# EAGLE design wad-pcb (EAGLE 9.6.2)
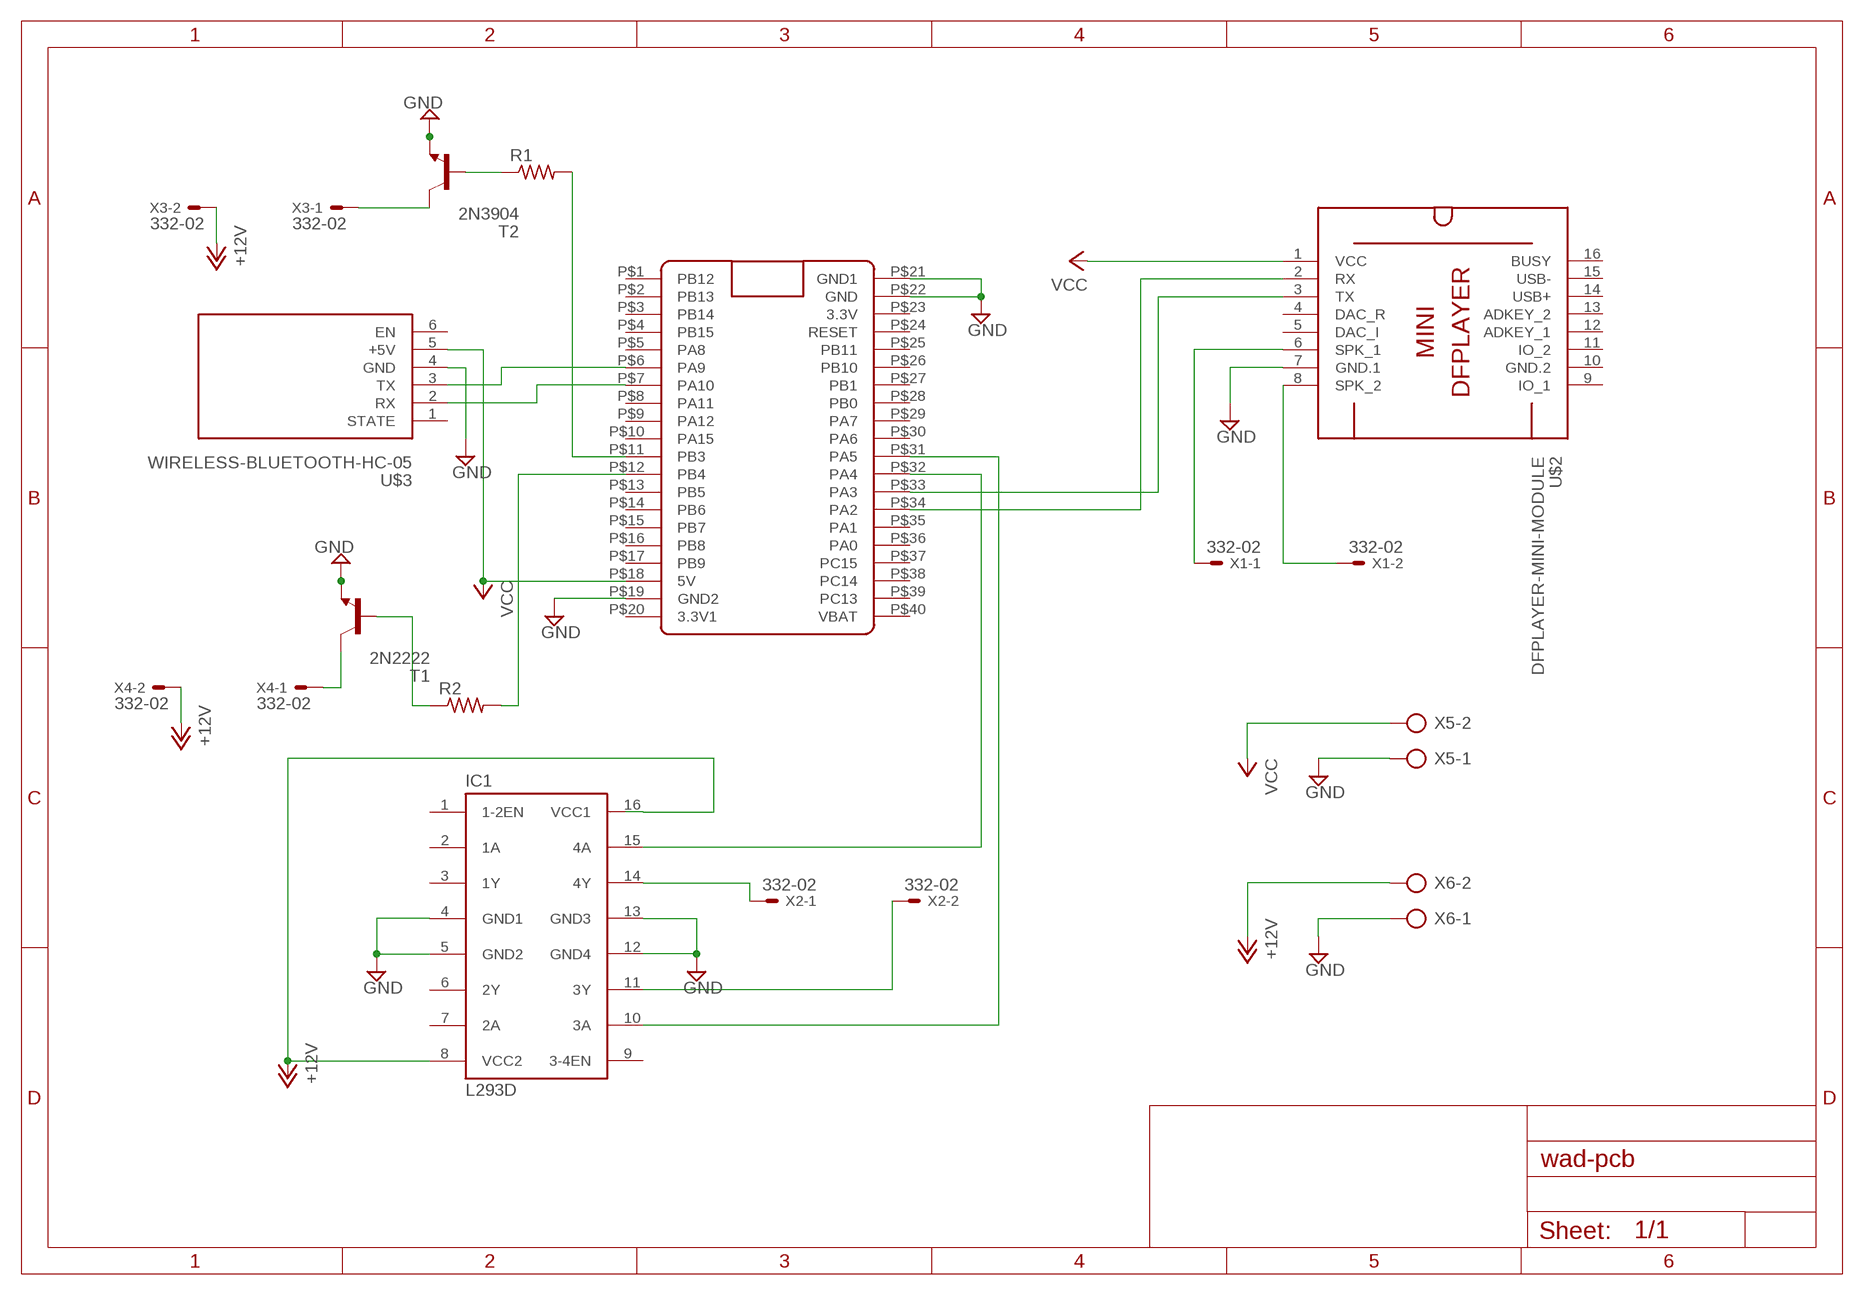
[diagram p0: schematic, sheet 1]

## Parts
IC1  L293D  [DIL16]
R1  R-US_0204/7  [0204/7]
R2  R-US_0204/7  [0204/7]
T1  2N2222  [TO18]
T2  2N3904  [TO92]
U$1  BLUE_PILL  [BLUE_PILL]
U$2  DFPLAYER-MINI-MODULE  [DFPLAYER-MINI-MODULE]
U$3  WIRELESS-BLUETOOTH-HC-05  [WIRELESS-BLUETOOTH-HC-05]
X1  332-02  [332-02]
X2  332-02  [332-02]
X3  332-02  [332-02]
X4  332-02  [332-02]
X5  AK500/2-H  [AK500/2-H]
X6  AK500/2-H  [AK500/2-H]

## Nets
+12V: IC1.8(VCC2) IC1.16(VCC1) X3.2 X4.2 X6.2
GND: IC1.4(GND1) IC1.5(GND2) IC1.12(GND4) IC1.13(GND3) T1.1(E) T2.3(E) U$1.P$19(GND2) U$1.P$21(GND1) U$1.P$22(GND) U$2.7(GND.1) U$3.4(GND) X5.1 X6.1
N$1: U$1.P$6(PA9) U$3.3(TX)
N$2: U$1.P$7(PA10) U$3.2(RX)
N$3: R1.1 T2.2(B)
N$4: R1.2 U$1.P$11(PB3)
N$5: R2.1 T1.2(B)
N$6: R2.2 U$1.P$12(PB4)
N$7: T2.1(C) X3.1
N$8: T1.3(C) X4.1
N$9: U$1.P$34(PA2) U$2.2(RX)
N$10: U$1.P$33(PA3) U$2.3(TX)
N$12: U$2.6(SPK_1) X1.1
N$13: U$2.8(SPK_2) X1.2
N$14: IC1.15(4A) U$1.P$32(PA4)
N$15: IC1.10(3A) U$1.P$31(PA5)
N$16: IC1.14(4Y) X2.1
N$17: IC1.11(3Y) X2.2
VCC: U$1.P$18(5V) U$2.1(VCC) U$3.5(+5V) X5.2
Unconnected: IC1.1(1-2EN) IC1.2(1A) IC1.3(1Y) IC1.6(2Y) IC1.7(2A) IC1.9(3-4EN) U$1.P$1(PB12) U$1.P$2(PB13) U$1.P$3(PB14) U$1.P$4(PB15) U$1.P$5(PA8) U$1.P$8(PA11) U$1.P$9(PA12) U$1.P$10(PA15) U$1.P$13(PB5) U$1.P$14(PB6) U$1.P$15(PB7) U$1.P$16(PB8) U$1.P$17(PB9) U$1.P$20(3.3V1) U$1.P$23(3.3V) U$1.P$24(RESET) U$1.P$25(PB11) U$1.P$26(PB10) U$1.P$27(PB1) U$1.P$28(PB0) U$1.P$29(PA7) U$1.P$30(PA6) U$1.P$35(PA1) U$1.P$36(PA0) U$1.P$37(PC15) U$1.P$38(PC14) U$1.P$39(PC13) U$1.P$40(VBAT) U$2.4(DAC_R) U$2.5(DAC_I) U$2.9(IO_1) U$2.11(IO_2) U$2.12(ADKEY_1) U$2.13(ADKEY_2) U$2.14(USB+) U$2.15(USB-) U$2.16(BUSY) U$3.1(STATE) U$3.6(EN)

## Power pins joined to a net without a drawn wire
GND.2: U$2.10(GND.2)

## Library data of the parts
IC1 = st-microelectronics:L293D: PUSH-PULL 4 CHANNEL DRIVER; MPN: L293D; OC_FARNELL: 9589619; OC_NEWARK: 56P8249
R1 R2 = rcl:R-US_: RESISTOR, American symbol; SPICEPREFIX: R
T1 = transistor:2N2222: NPN TRANSISTOR
T2 = transistor2:2N3904: NPN TRANSISTOR
U$1 = BluePill:BLUE_PILL
U$2 = diy-modules:DFPLAYER-MINI-MODULE: DFPlayer Mini - MP3 player module based on YX5200 chip More details available here: https://www.dfrobot.com/wiki/index.php/DFPlayer_Mini_SKU:DFR0299 Click here to find device on ebay.com <http://www.ebay.com/sch/dfplayer+mini>
U$3 = diy-modules:WIRELESS-BLUETOOTH-HC-05: Bluetooth Transceiver Module based on HC-05 board Tutorial is available here: https://arduino-info.wikispaces.com/BlueTooth-HC05-HC06-Modules-How-To Click here to find device on ebay.com <http://www.ebay.com/sch/hc-05+module+rs232>
X1-X4 = con-garry:332-02: 2 Pin - 2mm Dual Row Source: www.mpe-connector.de / garry_shortform_2012.pdf
X5 X6 = con-ptr500:AK500/2-H: CONNECTOR Aug. 2004 / PTR Meßtechnik: Die Bezeichnung der Serie AK505 wurde geändert. Es handelt sich hierbei um AK500 in horizontaler Ausführung.; OC_FARNELL: unknown; OC_NEWARK: unknown

## Board
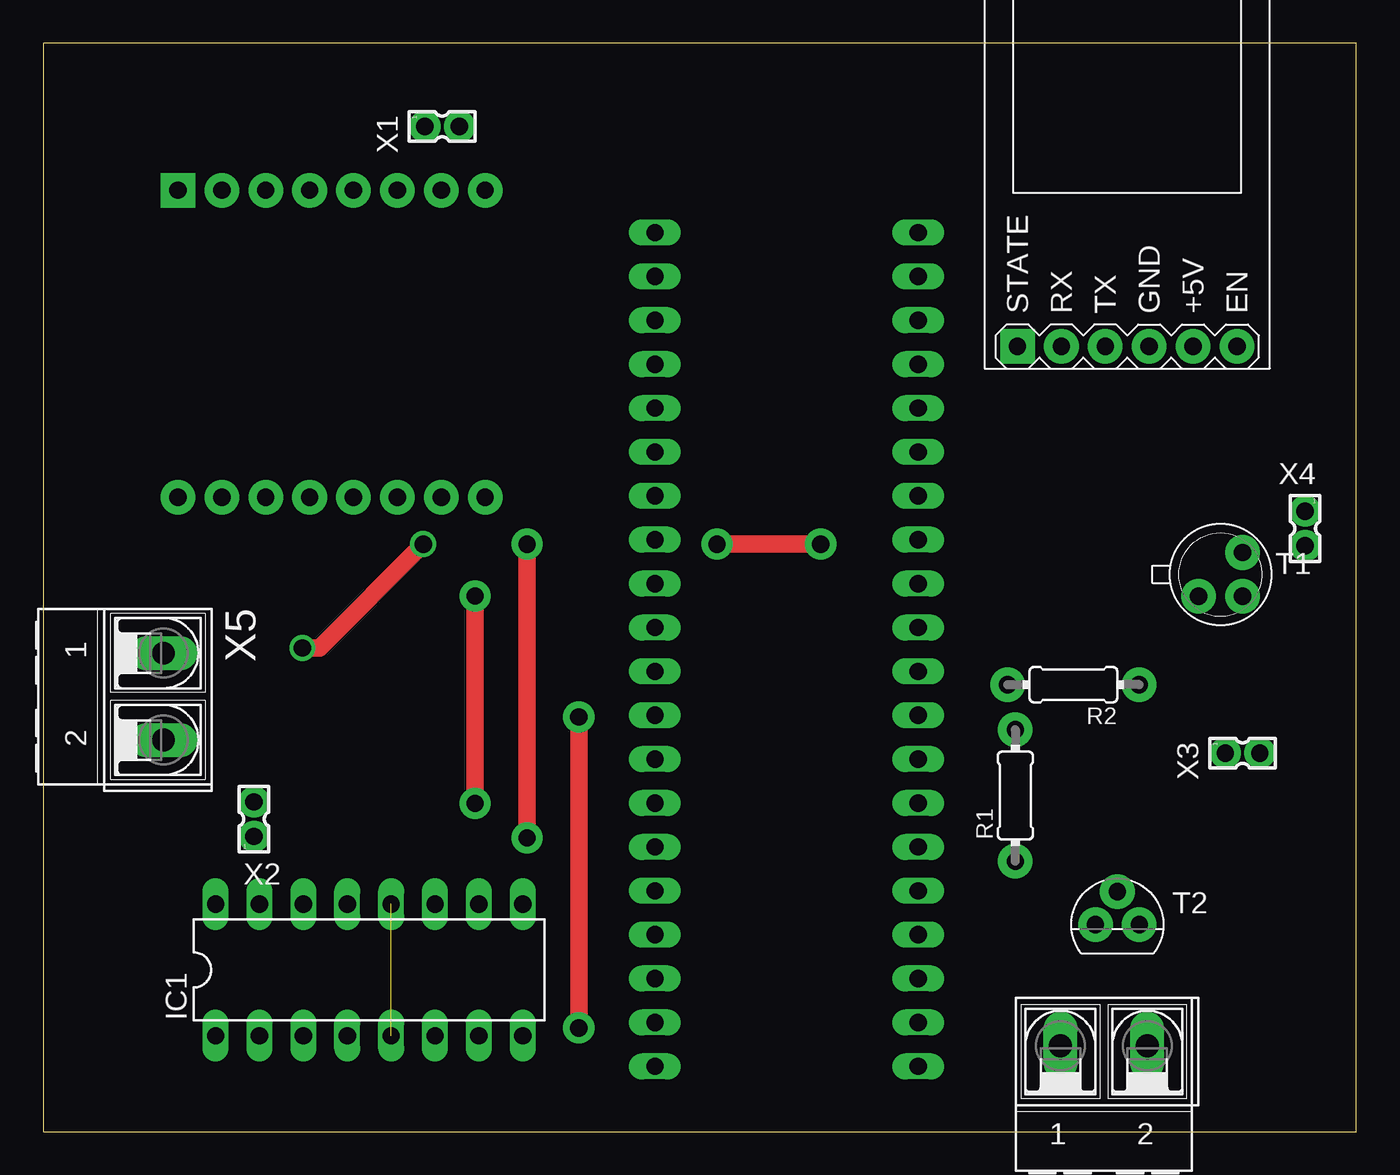
[diagram p1: board, top side]
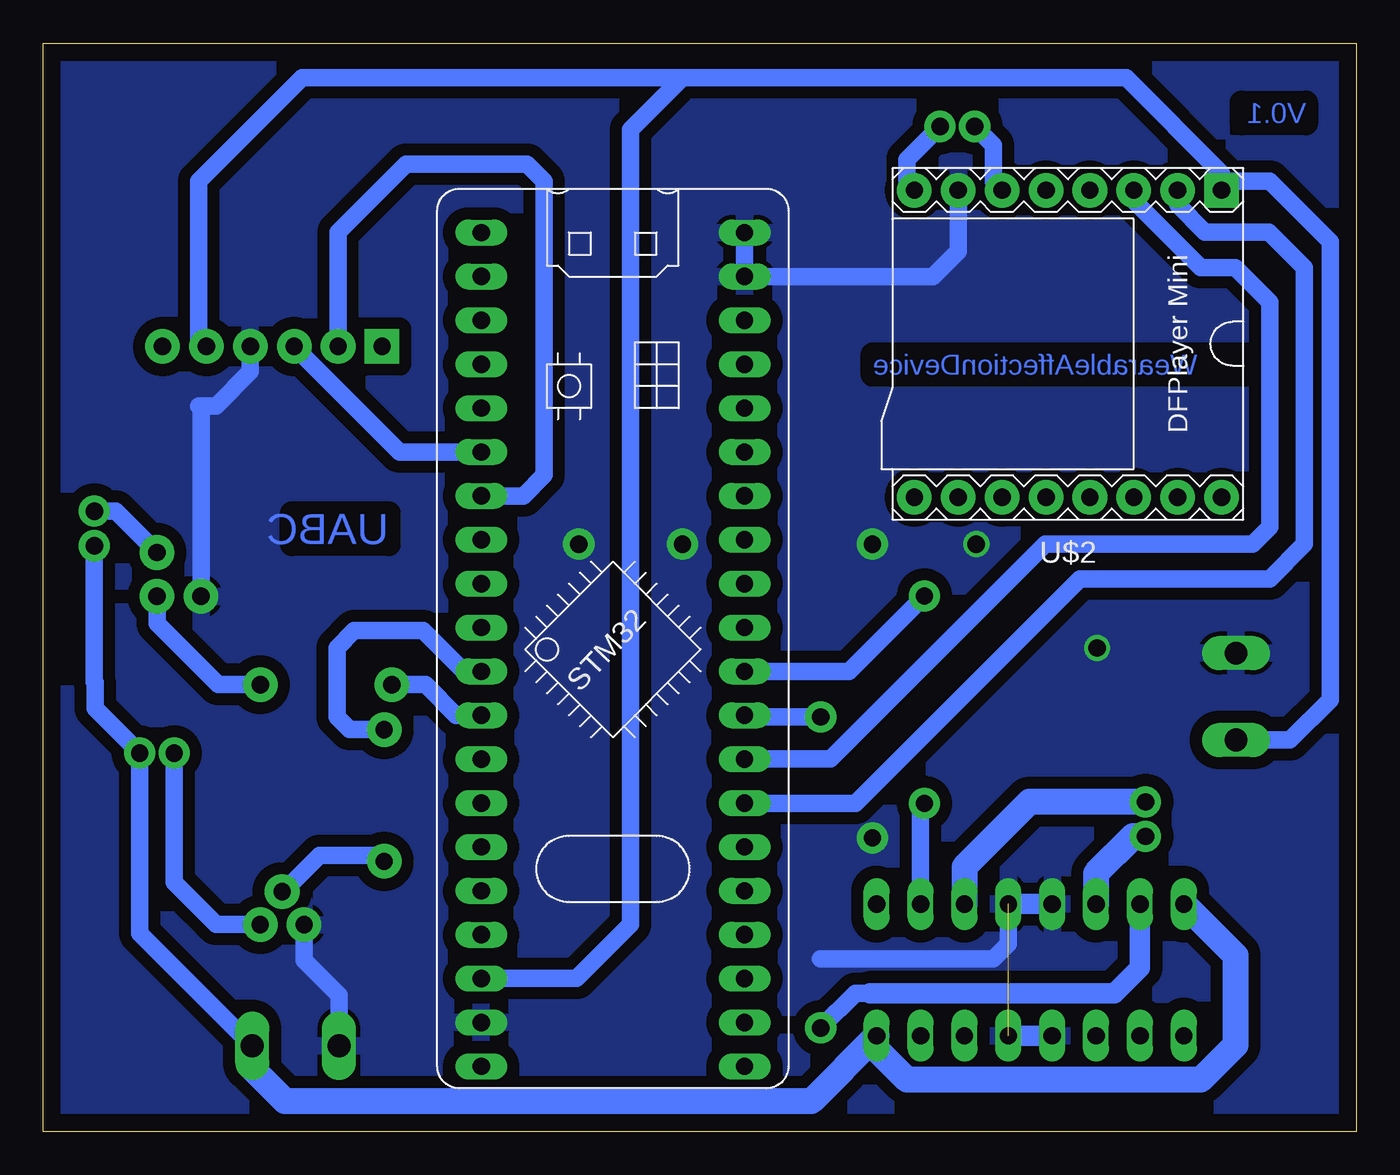
[diagram p2: board, bottom side, seen from below]

Size 76 x 63 mm. Coordinates in mm from the lower left corner, seen from the top.
Outline: 0,0 76,0 76,63 0,63 0,0
Copper layers (1*16): Top 0.035mm / dielectric 1.5mm / Bottom 0.035mm
Design rules "default": minimum track width 6mil, minimum drill 0.35mm, track to track 6mil, track to pad 6mil, pad to pad 6mil, via to via 6mil, smd to smd 6mil, copper to edge 40mil, drill to drill 6mil, minimum pad ring 10mil, minimum via ring 8mil, stop-mask expansion 4mil, vias tented up to drill 0mil, thermal gap 10mil

### Footprints (pad centres in the part's own frame; a part is rotated, then mirrored left to right if it is on the bottom)
DIL16 = drill 1 pad 1.5 long: 1 -8.89,-3.81; 2 -6.35,-3.81; 3 -3.81,-3.81; 4 -1.27,-3.81; 5 1.27,-3.81; 6 3.81,-3.81; 7 6.35,-3.81; 8 8.89,-3.81; 9 8.89,3.81; 10 6.35,3.81; 11 3.81,3.81; 12 1.27,3.81; 13 -1.27,3.81; 14 -3.81,3.81; 15 -6.35,3.81; 16 -8.89,3.81
0204/7 = drill 1 pad 2: 1 -3.81,0; 2 3.81,0
TO18 = drill 1 pad 2: 1 -1.27,-1.27; 2 1.27,-1.27; 3 1.27,1.27
TO92 = drill 1 pad 2: 1 1.27,0; 2 0,1.905; 3 -1.27,0
BLUE_PILL = drill 1 long: P$1 -7.62,15.24; P$2 -7.62,12.7; P$3 -7.62,10.16 | drill 1 pad 1.5 long: P$4 -7.62,7.62; P$5 -7.62,5.08; P$6 -7.62,2.54; P$7 -7.62,0; P$8 -7.62,-2.54; P$9 -7.62,-5.08; P$10 -7.62,-7.62; P$11 -7.62,-10.16; P$12 -7.62,-12.7; P$13 -7.62,-15.24; P$14 -7.62,-17.78; P$15 -7.62,-20.32; P$16 -7.62,-22.86; P$17 -7.62,-25.4; P$18 -7.62,-27.94; P$19 -7.62,-30.48; P$20 -7.62,-33.02; P$21 7.62,15.24; P$22 7.62,12.7; P$23 7.62,10.16; P$24 7.62,7.62; P$25 7.62,5.08; P$26 7.62,2.54; P$27 7.62,0; P$28 7.62,-2.54; P$29 7.62,-5.08; P$30 7.62,-7.62; P$31 7.62,-10.16; P$32 7.62,-12.7; P$33 7.62,-15.24; P$34 7.62,-17.78; P$35 7.62,-20.32; P$36 7.62,-22.86; P$37 7.62,-25.4; P$38 7.62,-27.94; P$39 7.62,-30.48; P$40 7.62,-33.02
DFPLAYER-MINI-MODULE = drill 1 pad 2 square: 1 -8.89,-8.89 | drill 1 pad 2: 2 -6.35,-8.89; 3 -3.81,-8.89; 4 -1.27,-8.89; 5 1.27,-8.89; 6 3.81,-8.89; 7 6.35,-8.89; 8 8.89,-8.89; 9 8.89,8.89; 10 6.35,8.89; 11 3.81,8.89; 12 1.27,8.89; 13 -1.27,8.89; 14 -3.81,8.89; 15 -6.35,8.89; 16 -8.89,8.89
WIRELESS-BLUETOOTH-HC-05 = drill 1 pad 2 square: 1 -6.35,-17.145 | drill 1 pad 2: 2 -3.81,-17.145; 3 -1.27,-17.145; 4 1.27,-17.145; 5 3.81,-17.145; 6 6.35,-17.145
332-02 = drill 1 pad 1.8: 1 0,-1; 2 0,1
AK500/2-H = drill 1.321 long: 1 -2.515,0; 2 2.515,0

### Placement (x,y rotation side)
IC1  18.87,9.36 0 top
R1  56.26,19.45 90 top
R2  59.62,25.87 180 top
T1  68.14,32.25 0 top
T2  62.17,11.98 0 top
U$1  43.03,36.8 0 bottom
U$2  16.69,45.6 180 bottom
U$3  62.74,62.59 0 top
X1  23.09,58.18 270 top
X2  12.2,18.09 0 top
X3  69.42,21.91 270 top
X4  73.04,34.91 180 top
X5  6.96,25.18 270 top
X6  61.39,4.96 0 top

### Tracks (layer width: path | path; a pad name or v marks a point on that pad's centre or on a via)
+12V
  Bottom 1: X3.2 70.51,22 | X6.2 70.42,11.47 X3.2 | X4.2 73.04,26.04 73,26 73,24.49 X3.2
  Bottom 1.5: X6.2 63.91,3.67 62,1.77 31.54,1.77 IC1.8 27.76,4.76 26,3 9,3 7,5 7,10.19 IC1.16
GND  (via drill 1 pad 1, 1 pad 1.8)  (1 unrouted)
  Top 1: v28,34 v28,17 | v39,34 v45,34 | v22,34 16,28 v15,28
  Bottom 1: U$3.4 64.01,43.99 66,42 67,42 66.87,41.87 T1.1 | 31,10 21,10 20.14,10.86 IC1.12 | T2.3 60.9,9.9 58.88,7.88 X6.1 | U$2.7 23.04,50.96 24.5,49.5 U$1.P$22 U$1.P$21
  Bottom 1.2: IC1.13 IC1.12 | IC1.4 IC1.5
  pour Bottom (isolate 0.7): 0,63 76,63 76,0 0,0
N$1
  Bottom 1: U$3.3 55.36,39.34 U$1.P$6
N$2
  Bottom 1: U$3.2 58.93,52.07 55,56 48,56 47,55 47,38 48.2,36.8 U$1.P$7
N$3
  Bottom 1: T2.2 62.12,13.88 60,16 56.62,16 R1.1
N$4
  Bottom 1: 55.73,23.27 R1.2 58.27,23.27 59,24 59,28 58,29 54,29 51.64,26.64 U$1.P$11
N$5
  Bottom 1: T1.2 69.41,29.41 65.87,25.87 R2.1
N$6
  Bottom 1: R2.2 53.87,25.87 52.1,24.1 U$1.P$12
N$7
  Bottom 1: T2.1 63.46,12 66,12 68.42,14.42 X3.1
N$8
  Bottom 1: X4.1 71.8,35.91 T1.3
N$9
  Bottom 1: U$1.P$34 35.39,19 29,19 16,32 5,32 3,34 3,50 5.07,52.07 8.76,52.07 10.34,53.65 U$2.2
N$10
  Bottom 1: U$2.3 12.88,53.88 9,50 7,50 5,48 5,35 6,34 18,34 30.44,21.56 U$1.P$33
N$12
  Bottom 1: X1.1 21,57.09 21,54.99 U$2.6
N$13
  Bottom 1: X1.2 26,56.27 26,54.91 U$2.8
N$14  (via drill 1 pad 1.8)
  Top 1: v31,24 v31,6
  Bottom 1: 28.15,8 29,8 v31,6 | U$1.P$32 35.31,24 v31,24
  Bottom 1.2: IC1.15 12.52,9.48 14,8 28.15,8
N$15  (via drill 1 pad 1.8)
  Top 1: v25,31 v25,19
  Bottom 1: U$1.P$31 29.36,26.64 v25,31 | v25,19 25.22,18.78 IC1.10
N$16
  Bottom 1.5: X2.1 12.91,17.09 15.06,14.94 IC1.14
N$17
  Bottom 1.5: X2.2 18.91,19.09 22.68,15.32 IC1.11
VCC
  Bottom 1: U$1.P$18 45.14,8.86 42,12 42,58 39,61 | U$3.5 67,45.9 67,55 61,61 39,61 | 39,61 13.31,61 7.8,55.49 U$2.1 7.29,55 5,55 1.52,51.52 1.52,25 3.85,22.66 X5.2

### Text on the board
Bottom: V0.1 | WearableAffectionDevice | UABC